# EAGLE schematic ILX544A_V2_B1 (EAGLE 6.2)
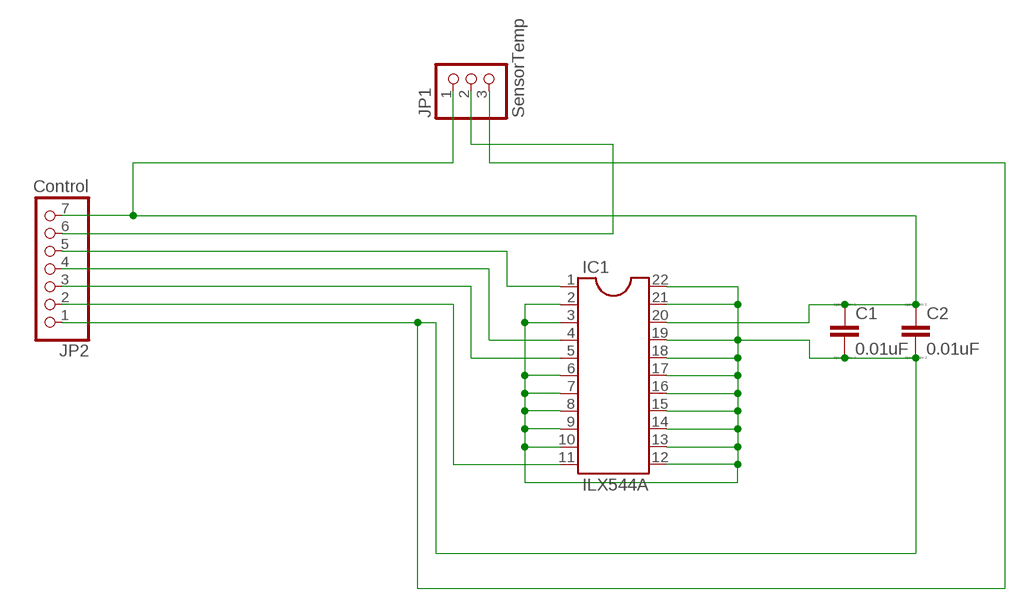
[diagram p0: schematic, sheet 1]

## Parts
C1  0.01uF  CC0402  [C0402]
C2  0.01uF  CC0402  [C0402]
IC1  ILX544A  DIL22-4  [DIL22-4]
JP1  SensorTemp  PINHD-1X3  [1X03]
JP2  Control  PINHD-1X7  [1X07]

## Nets
N$1: IC1.5 JP2.3
N$2: C1.1 C2.1 IC1.20 JP1.1 JP2.7
N$3: IC1.1 JP2.5
N$4: IC1.4 JP2.4
N$6: IC1.11 JP2.2
N$14: JP1.2 JP2.6
N$15: C1.2 C2.2 IC1.2 IC1.3 IC1.6 IC1.7 IC1.8 IC1.9 IC1.10 IC1.12 IC1.13 IC1.14 IC1.15 IC1.16 IC1.17 IC1.18 IC1.19 IC1.21 IC1.22 JP1.3 JP2.1

## Library data of the parts
C1 C2 = eagle-ltspice:C: CAPACITOR, European symbol; SPICEMODEL: NONE; SPICEPREFIX: C
IC1 = ic-package:DIL22: Dual In Line / Socket
JP1 = pinhead:PINHD-1X3: PIN HEADER
JP2 = pinhead:PINHD-1X7: PIN HEADER